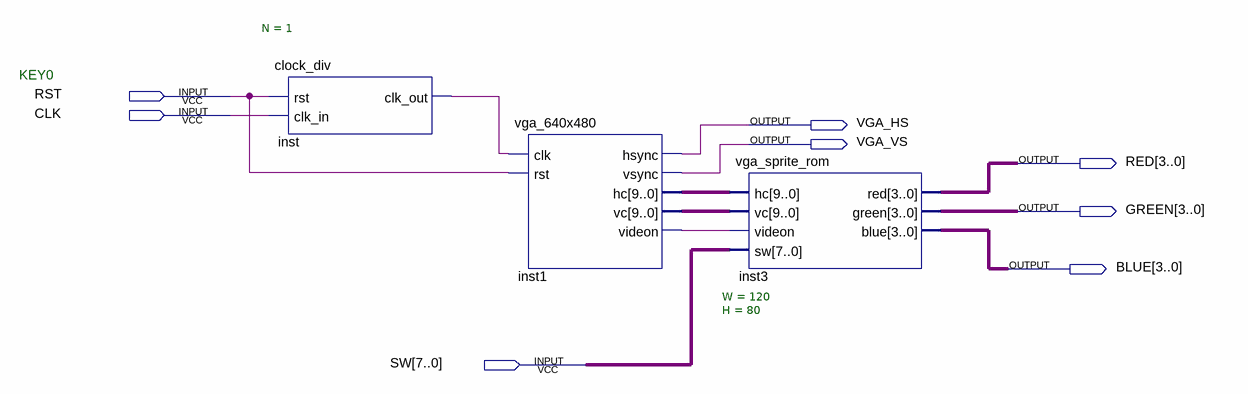
[diagram p0: schematic sheet]
// Quartus schematic top.bdf as structural Verilog: 3 symbols, 8 pins
module top (
  input  RST,
  input  CLK,
  input  [7:0] SW,
  output VGA_HS,
  output VGA_VS,
  output [3:0] RED,
  output [3:0] GREEN,
  output [3:0] BLUE
);

  wire inst1_videon, inst_clk_out;
  wire [9:0] inst1_hc, inst1_vc;

  clock_div #(.N(1)) inst (.rst(RST), .clk_in(CLK), .clk_out(inst_clk_out));
  vga_640x480 inst1 (
    .clk(inst_clk_out), .rst(RST), .hsync(VGA_HS), .vsync(VGA_VS), .hc(inst1_hc), .vc(inst1_vc),
    .videon(inst1_videon));
  vga_sprite_rom #(.W(120), .H(80)) inst3 (
    .hc(inst1_hc), .vc(inst1_vc), .videon(inst1_videon), .sw(SW), .red(RED), .green(GREEN), .blue(BLUE));

  // Notes on the sheet:
  //   KEY0
endmodule
